# Altium schematic sheet 2VFAT_OH2_OCT1.SchDoc
size 420 x 297 mm
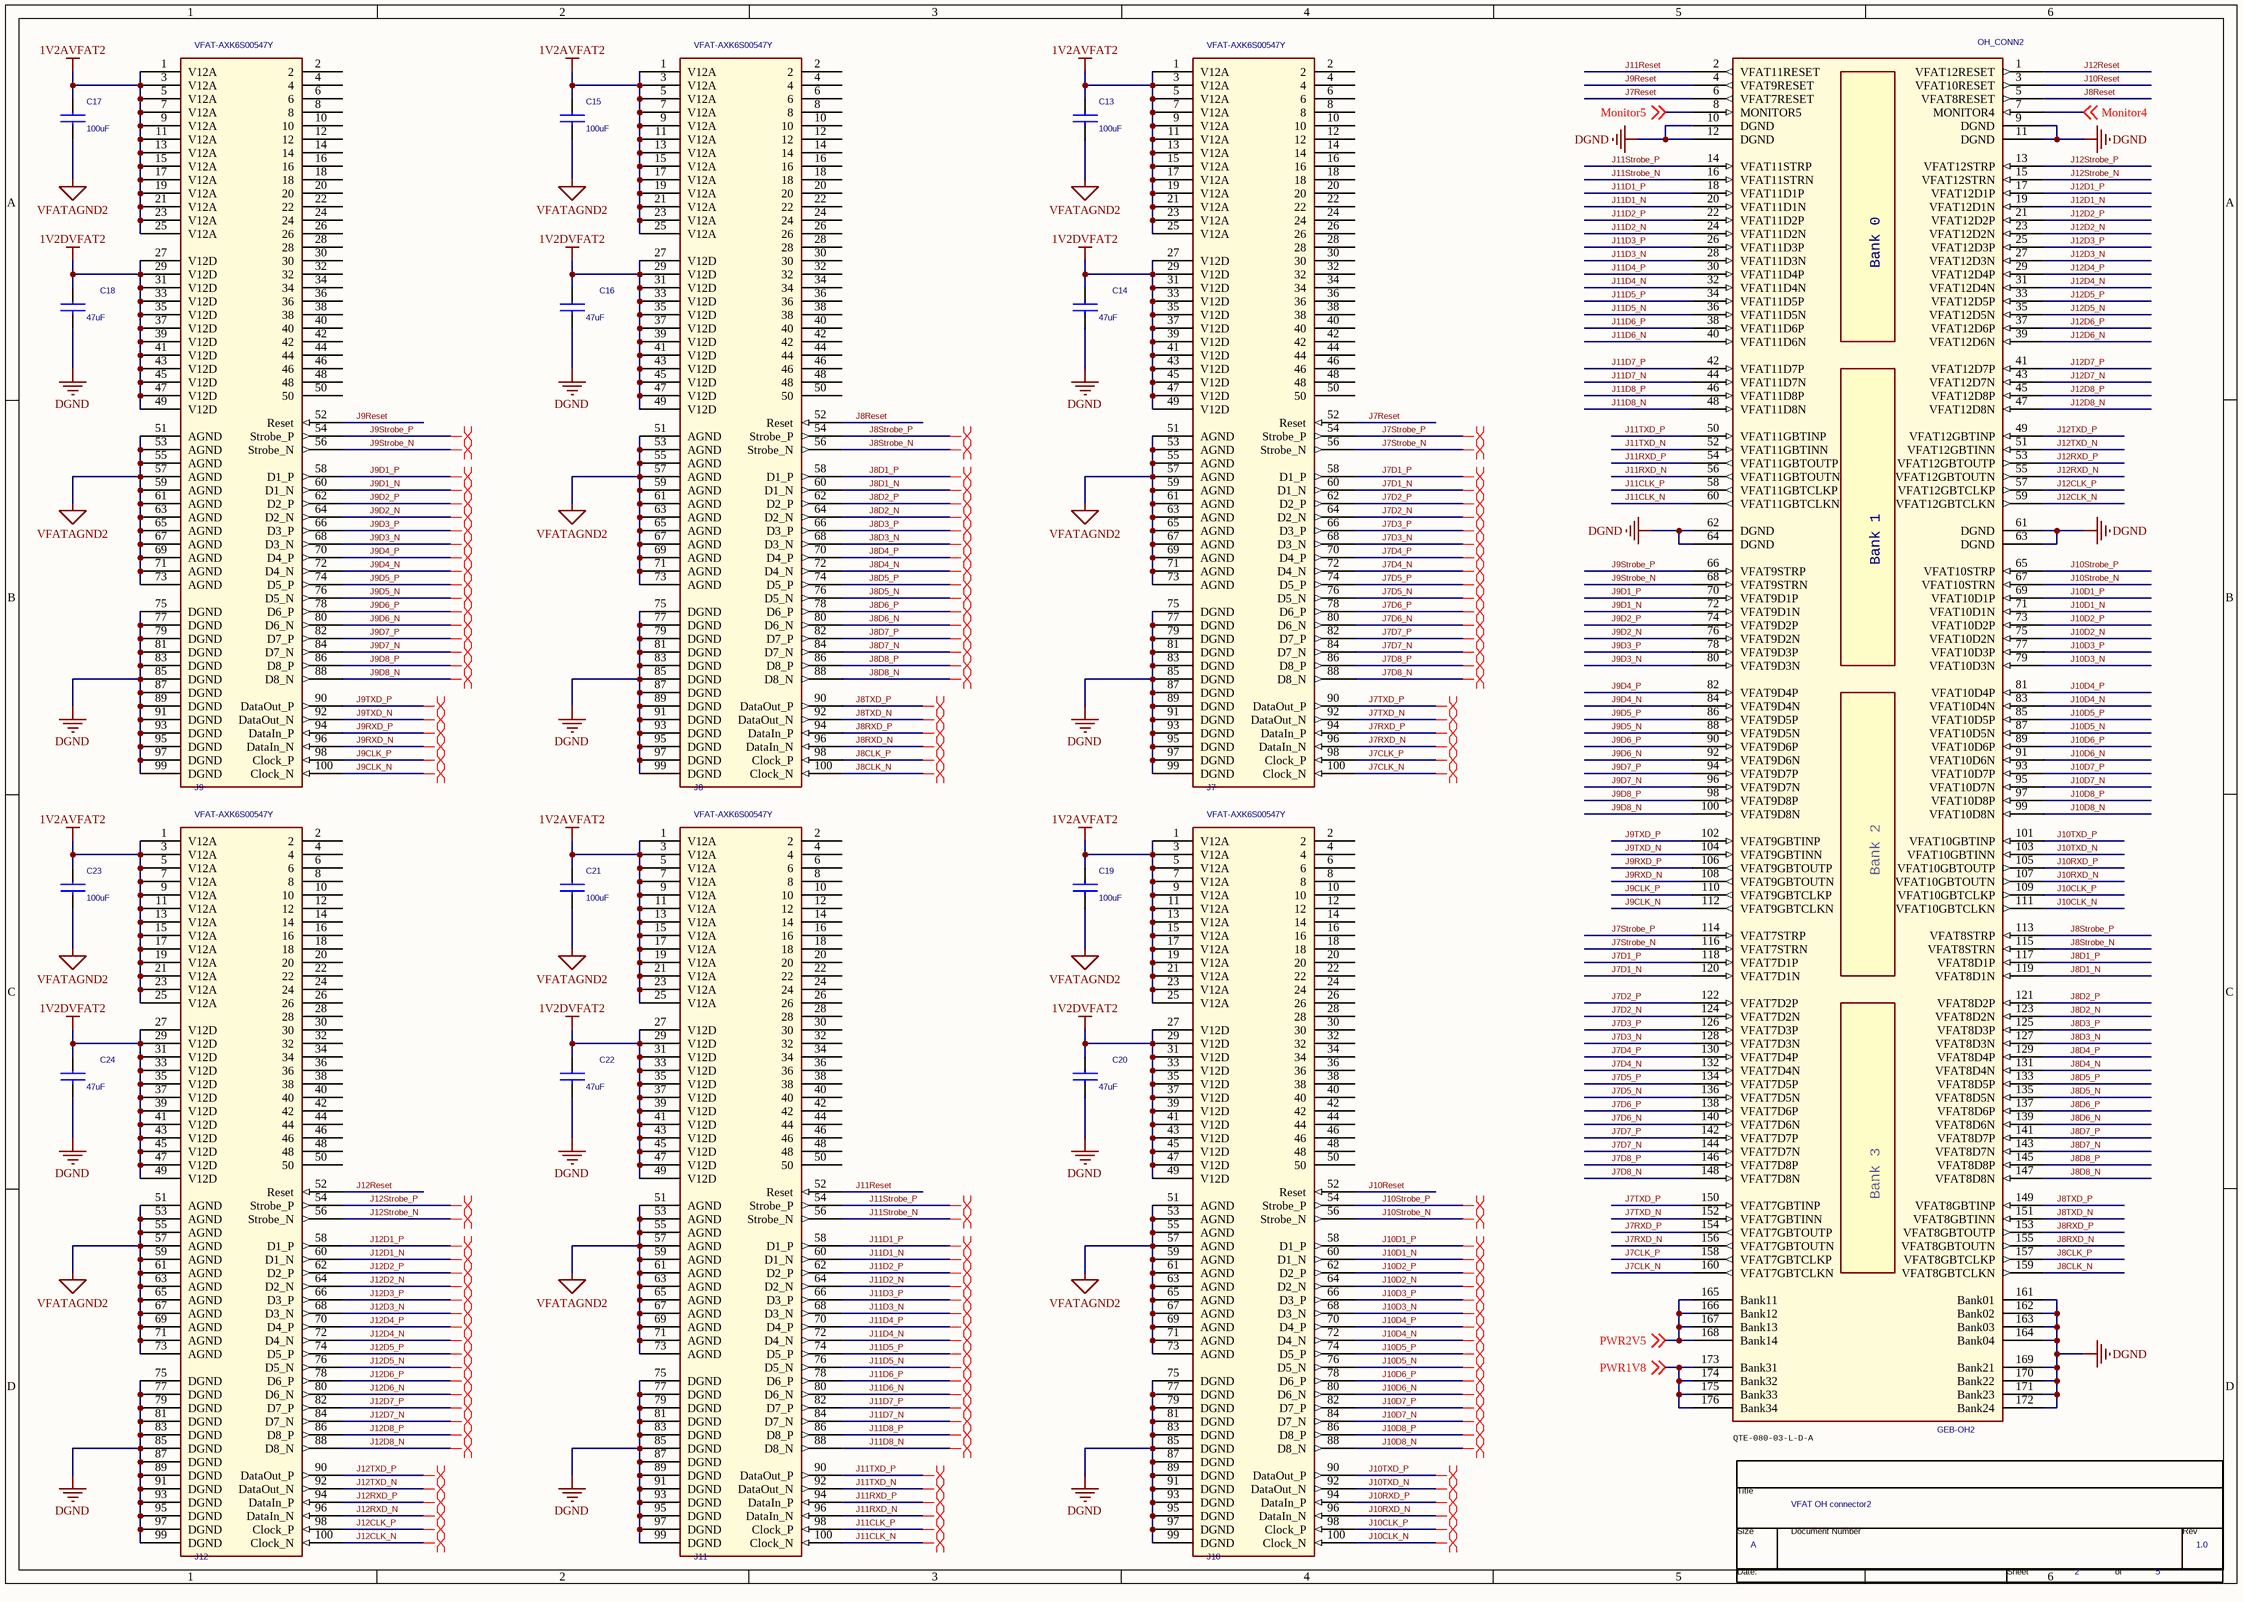
[diagram p0: 2VFAT_OH2_OCT1.SchDoc]

## Parts
*  Page Count: 5  Page Number: 2  Page Size: A  Title: VFAT OH connector2  RevCode: 1.0  (hidden comment: TitleBlock0)  (graphical)
C13  100uF  [C1210]
C14  47uF  [C1206]
C15  100uF  [C1210]
C16  47uF  [C1206]
C17  100uF  [C1210]
C18  47uF  [C1206]
C19  100uF  [C1210]
C20  47uF  [C1206]
C21  100uF  [C1210]
C22  47uF  [C1206]
C23  100uF  [C1210]
C24  47uF  [C1206]
J7  VFAT-AXK6S00547Y  [panasonic100]
J8  VFAT-AXK6S00547Y  [panasonic100]
J9  VFAT-AXK6S00547Y  [panasonic100]
J10  VFAT-AXK6S00547Y  [panasonic100]
J11  VFAT-AXK6S00547Y  [panasonic100]
J12  VFAT-AXK6S00547Y  [panasonic100]
OH_CONN2  GEB-OH2  [samtec160]

## Nets
1V2AVFAT2: C13.1 C15.1 C17.1 C19.1 C21.1 C23.1 J7.1(V12A) J7.3(V12A) J7.5(V12A) J7.7(V12A) J7.9(V12A) J7.11(V12A) J7.13(V12A) J7.15(V12A) J7.17(V12A) J7.19(V12A) J7.21(V12A) J7.23(V12A) J7.25(V12A) J8.1(V12A) J8.3(V12A) J8.5(V12A) J8.7(V12A) J8.9(V12A) J8.11(V12A) J8.13(V12A) J8.15(V12A) J8.17(V12A) J8.19(V12A) J8.21(V12A) J8.23(V12A) J8.25(V12A) J9.1(V12A) J9.3(V12A) J9.5(V12A) J9.7(V12A) J9.9(V12A) J9.11(V12A) J9.13(V12A) J9.15(V12A) J9.17(V12A) J9.19(V12A) J9.21(V12A) J9.23(V12A) J9.25(V12A) J10.1(V12A) J10.3(V12A) J10.5(V12A) J10.7(V12A) J10.9(V12A) J10.11(V12A) J10.13(V12A) J10.15(V12A) J10.17(V12A) J10.19(V12A) J10.21(V12A) J10.23(V12A) J10.25(V12A) J11.1(V12A) J11.3(V12A) J11.5(V12A) J11.7(V12A) J11.9(V12A) J11.11(V12A) J11.13(V12A) J11.15(V12A) J11.17(V12A) J11.19(V12A) J11.21(V12A) J11.23(V12A) J11.25(V12A) J12.1(V12A) J12.3(V12A) J12.5(V12A) J12.7(V12A) J12.9(V12A) J12.11(V12A) J12.13(V12A) J12.15(V12A) J12.17(V12A) J12.19(V12A) J12.21(V12A) J12.23(V12A) J12.25(V12A)
1V2DVFAT2: C14.1 C16.1 C18.1 C20.1 C22.1 C24.1 J7.27(V12D) J7.29(V12D) J7.31(V12D) J7.33(V12D) J7.35(V12D) J7.37(V12D) J7.39(V12D) J7.41(V12D) J7.43(V12D) J7.45(V12D) J7.47(V12D) J7.49(V12D) J8.27(V12D) J8.29(V12D) J8.31(V12D) J8.33(V12D) J8.35(V12D) J8.37(V12D) J8.39(V12D) J8.41(V12D) J8.43(V12D) J8.45(V12D) J8.47(V12D) J8.49(V12D) J9.27(V12D) J9.29(V12D) J9.31(V12D) J9.33(V12D) J9.35(V12D) J9.37(V12D) J9.39(V12D) J9.41(V12D) J9.43(V12D) J9.45(V12D) J9.47(V12D) J9.49(V12D) J10.27(V12D) J10.29(V12D) J10.31(V12D) J10.33(V12D) J10.35(V12D) J10.37(V12D) J10.39(V12D) J10.41(V12D) J10.43(V12D) J10.45(V12D) J10.47(V12D) J10.49(V12D) J11.27(V12D) J11.29(V12D) J11.31(V12D) J11.33(V12D) J11.35(V12D) J11.37(V12D) J11.39(V12D) J11.41(V12D) J11.43(V12D) J11.45(V12D) J11.47(V12D) J11.49(V12D) J12.27(V12D) J12.29(V12D) J12.31(V12D) J12.33(V12D) J12.35(V12D) J12.37(V12D) J12.39(V12D) J12.41(V12D) J12.43(V12D) J12.45(V12D) J12.47(V12D) J12.49(V12D)
DGND: C14.2 C16.2 C18.2 C20.2 C22.2 C24.2 J7.75(DGND) J7.77(DGND) J7.79(DGND) J7.81(DGND) J7.83(DGND) J7.85(DGND) J7.87(DGND) J7.89(DGND) J7.91(DGND) J7.93(DGND) J7.95(DGND) J7.97(DGND) J7.99(DGND) J8.75(DGND) J8.77(DGND) J8.79(DGND) J8.81(DGND) J8.83(DGND) J8.85(DGND) J8.87(DGND) J8.89(DGND) J8.91(DGND) J8.93(DGND) J8.95(DGND) J8.97(DGND) J8.99(DGND) J9.75(DGND) J9.77(DGND) J9.79(DGND) J9.81(DGND) J9.83(DGND) J9.85(DGND) J9.87(DGND) J9.89(DGND) J9.91(DGND) J9.93(DGND) J9.95(DGND) J9.97(DGND) J9.99(DGND) J10.75(DGND) J10.77(DGND) J10.79(DGND) J10.81(DGND) J10.83(DGND) J10.85(DGND) J10.87(DGND) J10.89(DGND) J10.91(DGND) J10.93(DGND) J10.95(DGND) J10.97(DGND) J10.99(DGND) J11.75(DGND) J11.77(DGND) J11.79(DGND) J11.81(DGND) J11.83(DGND) J11.85(DGND) J11.87(DGND) J11.89(DGND) J11.91(DGND) J11.93(DGND) J11.95(DGND) J11.97(DGND) J11.99(DGND) J12.75(DGND) J12.77(DGND) J12.79(DGND) J12.81(DGND) J12.83(DGND) J12.85(DGND) J12.87(DGND) J12.89(DGND) J12.91(DGND) J12.93(DGND) J12.95(DGND) J12.97(DGND) J12.99(DGND) OH_CONN2.9(DGND) OH_CONN2.10(DGND) OH_CONN2.11(DGND) OH_CONN2.12(DGND) OH_CONN2.61(DGND) OH_CONN2.62(DGND) OH_CONN2.63(DGND) OH_CONN2.64(DGND) OH_CONN2.161(Bank01) OH_CONN2.162(Bank02) OH_CONN2.163(Bank03) OH_CONN2.164(Bank04) OH_CONN2.169(Bank21) OH_CONN2.170(Bank22) OH_CONN2.171(Bank23) OH_CONN2.172(Bank24)
VFATAGND2: C13.2 C15.2 C17.2 C19.2 C21.2 C23.2 J7.51(AGND) J7.53(AGND) J7.55(AGND) J7.57(AGND) J7.59(AGND) J7.61(AGND) J7.63(AGND) J7.65(AGND) J7.67(AGND) J7.69(AGND) J7.71(AGND) J7.73(AGND) J8.51(AGND) J8.53(AGND) J8.55(AGND) J8.57(AGND) J8.59(AGND) J8.61(AGND) J8.63(AGND) J8.65(AGND) J8.67(AGND) J8.69(AGND) J8.71(AGND) J8.73(AGND) J9.51(AGND) J9.53(AGND) J9.55(AGND) J9.57(AGND) J9.59(AGND) J9.61(AGND) J9.63(AGND) J9.65(AGND) J9.67(AGND) J9.69(AGND) J9.71(AGND) J9.73(AGND) J10.51(AGND) J10.53(AGND) J10.55(AGND) J10.57(AGND) J10.59(AGND) J10.61(AGND) J10.63(AGND) J10.65(AGND) J10.67(AGND) J10.69(AGND) J10.71(AGND) J10.73(AGND) J11.51(AGND) J11.53(AGND) J11.55(AGND) J11.57(AGND) J11.59(AGND) J11.61(AGND) J11.63(AGND) J11.65(AGND) J11.67(AGND) J11.69(AGND) J11.71(AGND) J11.73(AGND) J12.51(AGND) J12.53(AGND) J12.55(AGND) J12.57(AGND) J12.59(AGND) J12.61(AGND) J12.63(AGND) J12.65(AGND) J12.67(AGND) J12.69(AGND) J12.71(AGND) J12.73(AGND)
J7CLK_N: J7.100(Clock_N) OH_CONN2.160(VFAT7GBTCLKN)
J7CLK_P: J7.98(Clock_P) OH_CONN2.158(VFAT7GBTCLKP)
J7D1_N: J7.60(D1_N) OH_CONN2.120(VFAT7D1N)
J7D1_P: J7.58(D1_P) OH_CONN2.118(VFAT7D1P)
J7D2_N: J7.64(D2_N) OH_CONN2.124(VFAT7D2N)
J7D2_P: J7.62(D2_P) OH_CONN2.122(VFAT7D2P)
J7D3_N: J7.68(D3_N) OH_CONN2.128(VFAT7D3N)
J7D3_P: J7.66(D3_P) OH_CONN2.126(VFAT7D3P)
J7D4_N: J7.72(D4_N) OH_CONN2.132(VFAT7D4N)
J7D4_P: J7.70(D4_P) OH_CONN2.130(VFAT7D4P)
J7D5_N: J7.76(D5_N) OH_CONN2.136(VFAT7D5N)
J7D5_P: J7.74(D5_P) OH_CONN2.134(VFAT7D5P)
J7D6_N: J7.80(D6_N) OH_CONN2.140(VFAT7D6N)
J7D6_P: J7.78(D6_P) OH_CONN2.138(VFAT7D6P)
J7D7_N: J7.84(D7_N) OH_CONN2.144(VFAT7D7N)
J7D7_P: J7.82(D7_P) OH_CONN2.142(VFAT7D7P)
J7D8_N: J7.88(D8_N) OH_CONN2.148(VFAT7D8N)
J7D8_P: J7.86(D8_P) OH_CONN2.146(VFAT7D8P)
J7Reset: J7.52(Reset) OH_CONN2.6(VFAT7RESET)
J7RXD_N: J7.96(DataIn_N) OH_CONN2.156(VFAT7GBTOUTN)
J7RXD_P: J7.94(DataIn_P) OH_CONN2.154(VFAT7GBTOUTP)
J7Strobe_N: J7.56(Strobe_N) OH_CONN2.116(VFAT7STRN)
J7Strobe_P: J7.54(Strobe_P) OH_CONN2.114(VFAT7STRP)
J7TXD_N: J7.92(DataOut_N) OH_CONN2.152(VFAT7GBTINN)
J7TXD_P: J7.90(DataOut_P) OH_CONN2.150(VFAT7GBTINP)
J8CLK_N: J8.100(Clock_N) OH_CONN2.159(VFAT8GBTCLKN)
J8CLK_P: J8.98(Clock_P) OH_CONN2.157(VFAT8GBTCLKP)
J8D1_N: J8.60(D1_N) OH_CONN2.119(VFAT8D1N)
J8D1_P: J8.58(D1_P) OH_CONN2.117(VFAT8D1P)
J8D2_N: J8.64(D2_N) OH_CONN2.123(VFAT8D2N)
J8D2_P: J8.62(D2_P) OH_CONN2.121(VFAT8D2P)
J8D3_N: J8.68(D3_N) OH_CONN2.127(VFAT8D3N)
J8D3_P: J8.66(D3_P) OH_CONN2.125(VFAT8D3P)
J8D4_N: J8.72(D4_N) OH_CONN2.131(VFAT8D4N)
J8D4_P: J8.70(D4_P) OH_CONN2.129(VFAT8D4P)
J8D5_N: J8.76(D5_N) OH_CONN2.135(VFAT8D5N)
J8D5_P: J8.74(D5_P) OH_CONN2.133(VFAT8D5P)
J8D6_N: J8.80(D6_N) OH_CONN2.139(VFAT8D6N)
J8D6_P: J8.78(D6_P) OH_CONN2.137(VFAT8D6P)
J8D7_N: J8.84(D7_N) OH_CONN2.143(VFAT8D7N)
J8D7_P: J8.82(D7_P) OH_CONN2.141(VFAT8D7P)
J8D8_N: J8.88(D8_N) OH_CONN2.147(VFAT8D8N)
J8D8_P: J8.86(D8_P) OH_CONN2.145(VFAT8D8P)
J8Reset: J8.52(Reset) OH_CONN2.5(VFAT8RESET)
J8RXD_N: J8.96(DataIn_N) OH_CONN2.155(VFAT8GBTOUTN)
J8RXD_P: J8.94(DataIn_P) OH_CONN2.153(VFAT8GBTOUTP)
J8Strobe_N: J8.56(Strobe_N) OH_CONN2.115(VFAT8STRN)
J8Strobe_P: J8.54(Strobe_P) OH_CONN2.113(VFAT8STRP)
J8TXD_N: J8.92(DataOut_N) OH_CONN2.151(VFAT8GBTINN)
J8TXD_P: J8.90(DataOut_P) OH_CONN2.149(VFAT8GBTINP)
J9CLK_N: J9.100(Clock_N) OH_CONN2.112(VFAT9GBTCLKN)
J9CLK_P: J9.98(Clock_P) OH_CONN2.110(VFAT9GBTCLKP)
J9D1_N: J9.60(D1_N) OH_CONN2.72(VFAT9D1N)
J9D1_P: J9.58(D1_P) OH_CONN2.70(VFAT9D1P)
J9D2_N: J9.64(D2_N) OH_CONN2.76(VFAT9D2N)
J9D2_P: J9.62(D2_P) OH_CONN2.74(VFAT9D2P)
J9D3_N: J9.68(D3_N) OH_CONN2.80(VFAT9D3N)
J9D3_P: J9.66(D3_P) OH_CONN2.78(VFAT9D3P)
J9D4_N: J9.72(D4_N) OH_CONN2.84(VFAT9D4N)
J9D4_P: J9.70(D4_P) OH_CONN2.82(VFAT9D4P)
J9D5_N: J9.76(D5_N) OH_CONN2.88(VFAT9D5N)
J9D5_P: J9.74(D5_P) OH_CONN2.86(VFAT9D5P)
J9D6_N: J9.80(D6_N) OH_CONN2.92(VFAT9D6N)
J9D6_P: J9.78(D6_P) OH_CONN2.90(VFAT9D6P)
J9D7_N: J9.84(D7_N) OH_CONN2.96(VFAT9D7N)
J9D7_P: J9.82(D7_P) OH_CONN2.94(VFAT9D7P)
J9D8_N: J9.88(D8_N) OH_CONN2.100(VFAT9D8N)
J9D8_P: J9.86(D8_P) OH_CONN2.98(VFAT9D8P)
J9Reset: J9.52(Reset) OH_CONN2.4(VFAT9RESET)
J9RXD_N: J9.96(DataIn_N) OH_CONN2.108(VFAT9GBTOUTN)
J9RXD_P: J9.94(DataIn_P) OH_CONN2.106(VFAT9GBTOUTP)
J9Strobe_N: J9.56(Strobe_N) OH_CONN2.68(VFAT9STRN)
J9Strobe_P: J9.54(Strobe_P) OH_CONN2.66(VFAT9STRP)
J9TXD_N: J9.92(DataOut_N) OH_CONN2.104(VFAT9GBTINN)
J9TXD_P: J9.90(DataOut_P) OH_CONN2.102(VFAT9GBTINP)
J10CLK_N: J10.100(Clock_N) OH_CONN2.111(VFAT10GBTCLKN)
J10CLK_P: J10.98(Clock_P) OH_CONN2.109(VFAT10GBTCLKP)
J10D1_N: J10.60(D1_N) OH_CONN2.71(VFAT10D1N)
J10D1_P: J10.58(D1_P) OH_CONN2.69(VFAT10D1P)
J10D2_N: J10.64(D2_N) OH_CONN2.75(VFAT10D2N)
J10D2_P: J10.62(D2_P) OH_CONN2.73(VFAT10D2P)
J10D3_N: J10.68(D3_N) OH_CONN2.79(VFAT10D3N)
J10D3_P: J10.66(D3_P) OH_CONN2.77(VFAT10D3P)
J10D4_N: J10.72(D4_N) OH_CONN2.83(VFAT10D4N)
J10D4_P: J10.70(D4_P) OH_CONN2.81(VFAT10D4P)
J10D5_N: J10.76(D5_N) OH_CONN2.87(VFAT10D5N)
J10D5_P: J10.74(D5_P) OH_CONN2.85(VFAT10D5P)
J10D6_N: J10.80(D6_N) OH_CONN2.91(VFAT10D6N)
J10D6_P: J10.78(D6_P) OH_CONN2.89(VFAT10D6P)
J10D7_N: J10.84(D7_N) OH_CONN2.95(VFAT10D7N)
J10D7_P: J10.82(D7_P) OH_CONN2.93(VFAT10D7P)
J10D8_N: J10.88(D8_N) OH_CONN2.99(VFAT10D8N)
J10D8_P: J10.86(D8_P) OH_CONN2.97(VFAT10D8P)
J10Reset: J10.52(Reset) OH_CONN2.3(VFAT10RESET)
J10RXD_N: J10.96(DataIn_N) OH_CONN2.107(VFAT10GBTOUTN)
J10RXD_P: J10.94(DataIn_P) OH_CONN2.105(VFAT10GBTOUTP)
J10Strobe_N: J10.56(Strobe_N) OH_CONN2.67(VFAT10STRN)
J10Strobe_P: J10.54(Strobe_P) OH_CONN2.65(VFAT10STRP)
J10TXD_N: J10.92(DataOut_N) OH_CONN2.103(VFAT10GBTINN)
J10TXD_P: J10.90(DataOut_P) OH_CONN2.101(VFAT10GBTINP)
J11CLK_N: J11.100(Clock_N) OH_CONN2.60(VFAT11GBTCLKN)
J11CLK_P: J11.98(Clock_P) OH_CONN2.58(VFAT11GBTCLKP)
J11D1_N: J11.60(D1_N) OH_CONN2.20(VFAT11D1N)
J11D1_P: J11.58(D1_P) OH_CONN2.18(VFAT11D1P)
J11D2_N: J11.64(D2_N) OH_CONN2.24(VFAT11D2N)
J11D2_P: J11.62(D2_P) OH_CONN2.22(VFAT11D2P)
J11D3_N: J11.68(D3_N) OH_CONN2.28(VFAT11D3N)
J11D3_P: J11.66(D3_P) OH_CONN2.26(VFAT11D3P)
J11D4_N: J11.72(D4_N) OH_CONN2.32(VFAT11D4N)
J11D4_P: J11.70(D4_P) OH_CONN2.30(VFAT11D4P)
J11D5_N: J11.76(D5_N) OH_CONN2.36(VFAT11D5N)
J11D5_P: J11.74(D5_P) OH_CONN2.34(VFAT11D5P)
J11D6_N: J11.80(D6_N) OH_CONN2.40(VFAT11D6N)
J11D6_P: J11.78(D6_P) OH_CONN2.38(VFAT11D6P)
J11D7_N: J11.84(D7_N) OH_CONN2.44(VFAT11D7N)
J11D7_P: J11.82(D7_P) OH_CONN2.42(VFAT11D7P)
J11D8_N: J11.88(D8_N) OH_CONN2.48(VFAT11D8N)
J11D8_P: J11.86(D8_P) OH_CONN2.46(VFAT11D8P)
J11Reset: J11.52(Reset) OH_CONN2.2(VFAT11RESET)
J11RXD_N: J11.96(DataIn_N) OH_CONN2.56(VFAT11GBTOUTN)
J11RXD_P: J11.94(DataIn_P) OH_CONN2.54(VFAT11GBTOUTP)
J11Strobe_N: J11.56(Strobe_N) OH_CONN2.16(VFAT11STRN)
J11Strobe_P: J11.54(Strobe_P) OH_CONN2.14(VFAT11STRP)
J11TXD_N: J11.92(DataOut_N) OH_CONN2.52(VFAT11GBTINN)
J11TXD_P: J11.90(DataOut_P) OH_CONN2.50(VFAT11GBTINP)
J12CLK_N: J12.100(Clock_N) OH_CONN2.59(VFAT12GBTCLKN)
J12CLK_P: J12.98(Clock_P) OH_CONN2.57(VFAT12GBTCLKP)
J12D1_N: J12.60(D1_N) OH_CONN2.19(VFAT12D1N)
J12D1_P: J12.58(D1_P) OH_CONN2.17(VFAT12D1P)
J12D2_N: J12.64(D2_N) OH_CONN2.23(VFAT12D2N)
J12D2_P: J12.62(D2_P) OH_CONN2.21(VFAT12D2P)
J12D3_N: J12.68(D3_N) OH_CONN2.27(VFAT12D3N)
J12D3_P: J12.66(D3_P) OH_CONN2.25(VFAT12D3P)
J12D4_N: J12.72(D4_N) OH_CONN2.31(VFAT12D4N)
J12D4_P: J12.70(D4_P) OH_CONN2.29(VFAT12D4P)
J12D5_N: J12.76(D5_N) OH_CONN2.35(VFAT12D5N)
J12D5_P: J12.74(D5_P) OH_CONN2.33(VFAT12D5P)
J12D6_N: J12.80(D6_N) OH_CONN2.39(VFAT12D6N)
J12D6_P: J12.78(D6_P) OH_CONN2.37(VFAT12D6P)
J12D7_N: J12.84(D7_N) OH_CONN2.43(VFAT12D7N)
J12D7_P: J12.82(D7_P) OH_CONN2.41(VFAT12D7P)
J12D8_N: J12.88(D8_N) OH_CONN2.47(VFAT12D8N)
J12D8_P: J12.86(D8_P) OH_CONN2.45(VFAT12D8P)
J12Reset: J12.52(Reset) OH_CONN2.1(VFAT12RESET)
J12RXD_N: J12.96(DataIn_N) OH_CONN2.55(VFAT12GBTOUTN)
J12RXD_P: J12.94(DataIn_P) OH_CONN2.53(VFAT12GBTOUTP)
J12Strobe_N: J12.56(Strobe_N) OH_CONN2.15(VFAT12STRN)
J12Strobe_P: J12.54(Strobe_P) OH_CONN2.13(VFAT12STRP)
J12TXD_N: J12.92(DataOut_N) OH_CONN2.51(VFAT12GBTINN)
J12TXD_P: J12.90(DataOut_P) OH_CONN2.49(VFAT12GBTINP)
Monitor4: OH_CONN2.7(MONITOR4) ; off-sheet Monitor4
Monitor5: OH_CONN2.8(MONITOR5) ; off-sheet Monitor5
PWR1V8: OH_CONN2.173(Bank31) OH_CONN2.174(Bank32) OH_CONN2.175(Bank33) OH_CONN2.176(Bank34) ; off-sheet PWR1V8
PWR2V5: OH_CONN2.165(Bank11) OH_CONN2.166(Bank12) OH_CONN2.167(Bank13) OH_CONN2.168(Bank14) ; off-sheet PWR2V5

Not connected (* = marked no-connect by the designer): J7 2 4 6 8 10 12 14 16 18 20 22 24 26 28 30 32 34 36 38 40 42 44 46 48 50; J8 2 4 6 8 10 12 14 16 18 20 22 24 26 28 30 32 34 36 38 40 42 44 46 48 50; J9 2 4 6 8 10 12 14 16 18 20 22 24 26 28 30 32 34 36 38 40 42 44 46 48 50; J10 2 4 6 8 10 12 14 16 18 20 22 24 26 28 30 32 34 36 38 40 42 44 46 48 50; J11 2 4 6 8 10 12 14 16 18 20 22 24 26 28 30 32 34 36 38 40 42 44 46 48 50; J12 2 4 6 8 10 12 14 16 18 20 22 24 26 28 30 32 34 36 38 40 42 44 46 48 50

## Layout directives
differential pair: J7CLK_N, J7CLK_P, J7D1_N, J7D1_P, J7D2_N, J7D2_P, J7D3_N, J7D3_P, J7D4_N, J7D4_P, J7D5_N, J7D5_P, J7D6_N, J7D6_P, J7D7_N, J7D7_P, J7D8_N, J7D8_P, J7RXD_N, J7RXD_P, J7Strobe_N, J7Strobe_P, J7TXD_N, J7TXD_P, J8CLK_N, J8CLK_P, J8D1_N, J8D1_P, J8D2_N, J8D2_P, J8D3_N, J8D3_P, J8D4_N, J8D4_P, J8D5_N, J8D5_P, J8D6_N, J8D6_P, J8D7_N, J8D7_P, J8D8_N, J8D8_P, J8RXD_N, J8RXD_P, J8Strobe_N, J8Strobe_P, J8TXD_N, J8TXD_P, J9CLK_N, J9CLK_P, J9D1_N, J9D1_P, J9D2_N, J9D2_P, J9D3_N, J9D3_P, J9D4_N, J9D4_P, J9D5_N, J9D5_P, J9D6_N, J9D6_P, J9D7_N, J9D7_P, J9D8_N, J9D8_P, J9RXD_N, J9RXD_P, J9Strobe_N, J9Strobe_P, J9TXD_N, J9TXD_P, J10CLK_N, J10CLK_P, J10D1_N, J10D1_P, J10D2_N, J10D2_P, J10D3_N, J10D3_P, J10D4_N, J10D4_P, J10D5_N, J10D5_P, J10D6_N, J10D6_P, J10D7_N, J10D7_P, J10D8_N, J10D8_P, J10RXD_N, J10RXD_P, J10Strobe_N, J10Strobe_P, J10TXD_N, J10TXD_P, J11CLK_N, J11CLK_P, J11D1_N, J11D1_P, J11D2_N, J11D2_P, J11D3_N, J11D3_P, J11D4_N, J11D4_P, J11D5_N, J11D5_P, J11D6_N, J11D6_P, J11D7_N, J11D7_P, J11D8_N, J11D8_P, J11RXD_N, J11RXD_P, J11Strobe_N, J11Strobe_P, J11TXD_N, J11TXD_P, J12CLK_N, J12CLK_P, J12D1_N, J12D1_P, J12D2_N, J12D2_P, J12D3_N, J12D3_P, J12D4_N, J12D4_P, J12D5_N, J12D5_P, J12D6_N, J12D6_P, J12D7_N, J12D7_P, J12D8_N, J12D8_P, J12RXD_N, J12RXD_P, J12Strobe_N, J12Strobe_P, J12TXD_N, J12TXD_P

## Notes on the sheet
- QTE-080-03-L-D-A
- (in symbol GEB-OH2) Bank 0; Bank 1; Bank 2; Bank 3
- (in symbol TitleBlock0) Title; Size; Document Number; Rev; Date:; Sheet; of

## Library data of the parts
C13-C24 = CAP NP
* = TitleBlock0: Page Create Date: March  8, 1995